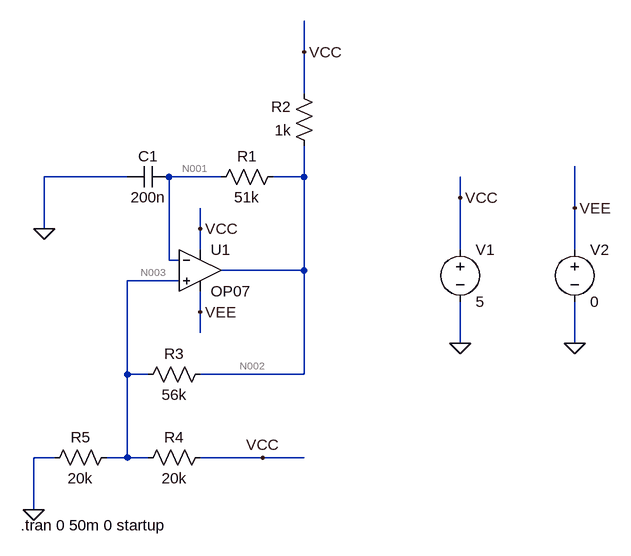
[diagram p0: schematic 1_12.asc]
1_12.asc, the LTspice schematic file:
Version 4
SHEET 1 880 680
WIRE 400 -192 400 -240
WIRE 400 -128 400 -192
WIRE 128 0 0 0
WIRE 272 0 192 0
WIRE 400 0 400 -48
WIRE 400 0 352 0
WIRE 640 32 640 0
WIRE 816 48 816 -16
WIRE 0 80 0 0
WIRE 240 80 240 48
WIRE 240 112 240 80
WIRE 640 112 640 32
WIRE 816 112 816 48
WIRE 192 128 192 0
WIRE 208 128 192 128
WIRE 400 144 400 0
WIRE 400 144 272 144
WIRE 208 160 128 160
WIRE 240 208 240 176
WIRE 240 240 240 208
WIRE 640 256 640 192
WIRE 816 256 816 192
WIRE 128 304 128 160
WIRE 160 304 128 304
WIRE 400 304 400 144
WIRE 400 304 240 304
WIRE 16 432 -16 432
WIRE 128 432 128 304
WIRE 128 432 96 432
WIRE 160 432 128 432
WIRE 336 432 240 432
WIRE 400 432 336 432
WIRE -16 512 -16 432
FLAG 0 80 0
FLAG -16 512 0
FLAG 400 -192 VCC
FLAG 336 432 VCC
FLAG 240 80 VCC
FLAG 240 208 VEE
FLAG 640 256 0
FLAG 816 256 0
FLAG 640 32 VCC
FLAG 816 48 VEE
SYMBOL OpAmps\\OP07 240 80 R0
SYMATTR InstName U1
SYMBOL cap 192 -16 R90
WINDOW 0 0 32 VBottom 2
WINDOW 3 32 32 VTop 2
SYMATTR InstName C1
SYMATTR Value 200n
SYMBOL res 368 -16 R90
WINDOW 0 0 56 VBottom 2
WINDOW 3 32 56 VTop 2
SYMATTR InstName R1
SYMATTR Value 51k
SYMBOL res 416 -32 R180
WINDOW 0 36 76 Left 2
WINDOW 3 36 40 Left 2
SYMATTR InstName R2
SYMATTR Value 1k
SYMBOL res 144 320 R270
WINDOW 0 32 56 VTop 2
WINDOW 3 0 56 VBottom 2
SYMATTR InstName R3
SYMATTR Value 56k
SYMBOL res 144 448 R270
WINDOW 0 32 56 VTop 2
WINDOW 3 0 56 VBottom 2
SYMATTR InstName R4
SYMATTR Value 20k
SYMBOL res 0 448 R270
WINDOW 0 32 56 VTop 2
WINDOW 3 0 56 VBottom 2
SYMATTR InstName R5
SYMATTR Value 20k
SYMBOL voltage 640 96 R0
WINDOW 123 0 0 Left 0
WINDOW 39 0 0 Left 0
SYMATTR InstName V1
SYMATTR Value 5
SYMBOL voltage 816 96 R0
WINDOW 123 0 0 Left 0
WINDOW 39 0 0 Left 0
SYMATTR InstName V2
SYMATTR Value 0
TEXT -36 536 Left 2 !.tran 0 50m 0 startup

The netlist it stands for:
* 1_12.asc
XU1 N003 N001 VCC VEE N002 LT1001  ; OP07, pins In+ In- V+ V- OUT
C1 N001 0 200n
R1 N002 N001 51k
R2 N002 VCC 1k
R3 N003 N002 56k
R4 N003 VCC 20k
R5 0 N003 20k
V1 VCC 0 5
V2 VEE 0 0
.tran 0 50m 0 startup
.lib LTC.lib
.backanno
.end

* Results of the author's LTspice run, read from the files saved beside the schematic
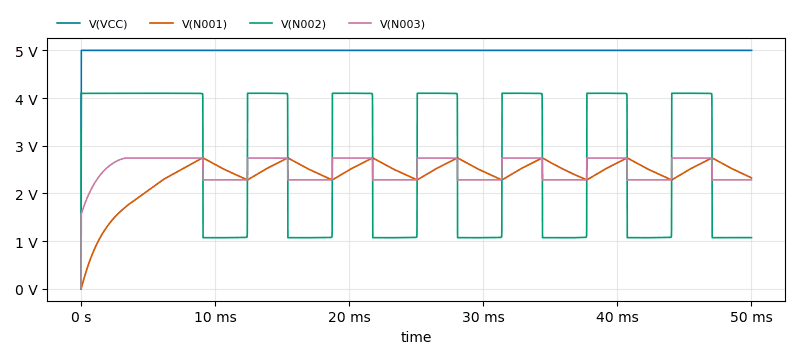
[diagram p1: Transient Analysis of 1_12.asc, plotted from the saved traces]
* Transient Analysis, 1 run:
*   V(VCC): min 0 V, max 5 V, average 4.999 V, rms 4.999 V, last 5 V
*   V(N001): min 2.44 µV, max 2.746 V, average 2.39 V, rms 2.427 V, last 2.327 V
*   V(N002): min 2.441 µV, max 4.101 V, average 2.716 V, rms 3.105 V, last 1.074 V
*   V(N003): min 370.1 nV, max 2.743 V, average 2.507 V, rms 2.519 V, last 2.284 V